# Altium project pulse_lim.PrjPCB
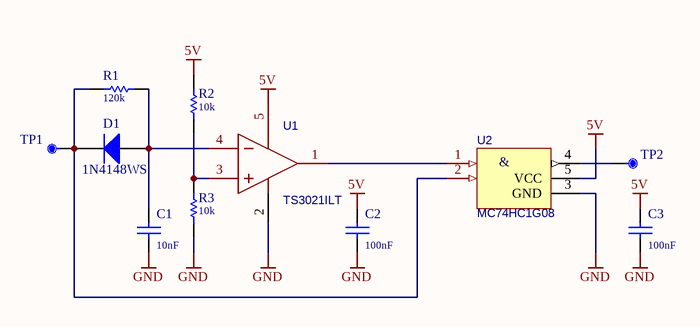
[diagram p0: schematic.SchDoc]
PRJ_VER: v1.0.0
1 sheet, 11 parts. Net scope: global (net labels, ports and power ports of the same name join across sheets).
Board file: board.PcbDoc

## Sheet schematic.SchDoc
size A4; SheetNumber: 6; SheetTotal: 29

### Parts
C1  10nF  [C0603]
C2  100nF  [C0603]
C3  100nF  [C0603]
D1  1N4148WS  [SOD-323]
R1  120k  [R0603]
R2  10k  [R0603]
R3  10k  [R0603]
TP1  (no value)  [TP2030_SMD]  (no BOM)
TP2  (no value)  [TP2030_SMD]  (no BOM)
U1  TS3021ILT  [SOT-23-5]
U2  MC74HC1G08  [SOT-23-5]

### Nets
5V: C2.2 C3.2 R2.2 U1.5(VCC+) U2.5(VCC)
GND: C1.1 C2.1 C3.1 R3.1 U1.2(VCC-) U2.3(GND)
NetC1_2: C1.2 D1.1(A) R1.1 U1.4(IN-)
NetD1_2: D1.2(K) R1.2 TP1.1 U2.2(B)
NetR2_1: R2.1 R3.2 U1.3(IN+)
NetTP2_1: TP2.1 U2.4(Y)
NetU1_1: U1.1(OUT) U2.1(A)

### Notes on the sheet
- (in symbol MC74HC1G08DTT1G) &

### Library data of the parts
C1 = CAP: 10nF 50V 0603
C2 C3 = CAP: 100nF 50V 0603
D1 = US1M-13-F
R1 = RES_0402_1K5-1%: 120k 5% 0603
R2 R3 = RES_0402_1K5-1%: 10k 5% 0603
TP1 TP2 = TP_Dup1
U2 = MC74HC1G08DTT1G